# Altium schematic sheet DSO_IO.SchDoc: Schematic_Name
size A4; CompanyName: University of Melbourne; Engineer: Your Name Here; DocumentNumber: 1; Revision: 0.1; SheetNumber: 1; SheetTotal: 1; Title_Project: Project_Title; StudentNo: Student No.
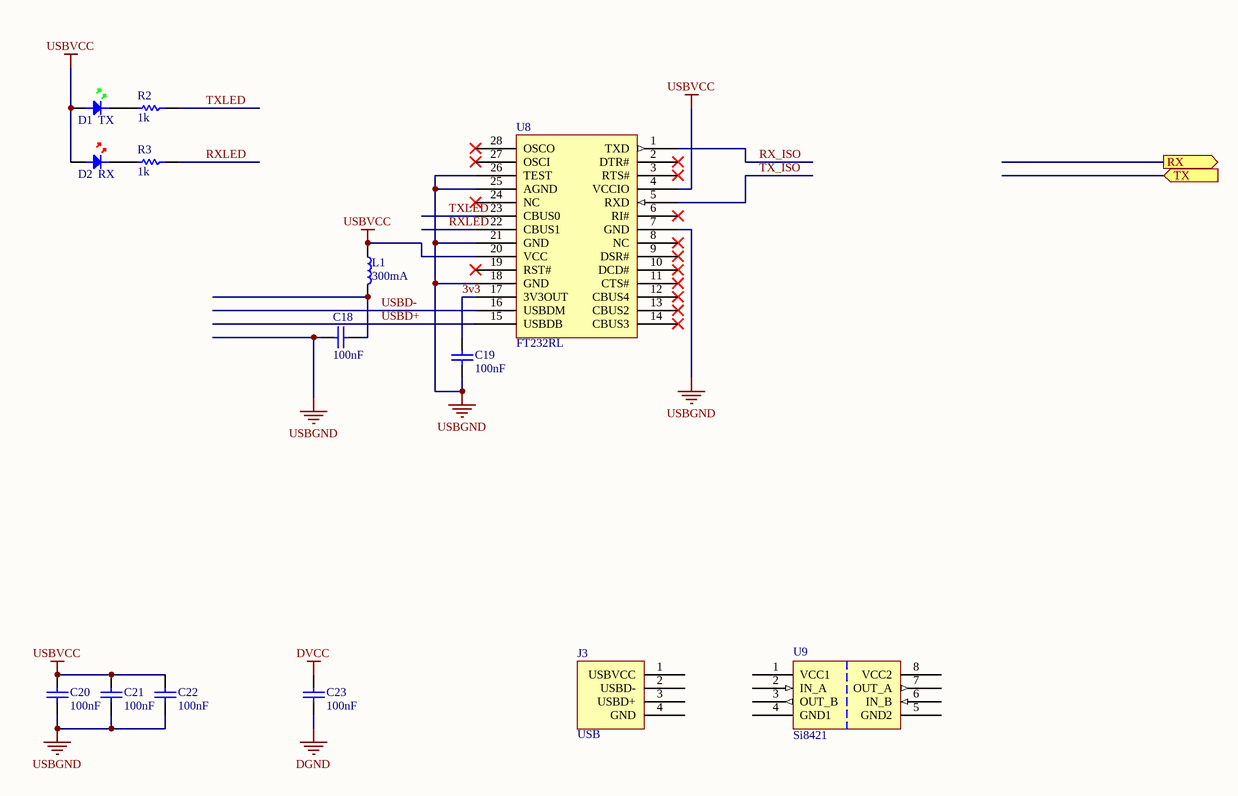
[diagram p0: DSO_IO.SchDoc]

## Parts
C18  100nF  [0805C]
C19  100nF  [0805C]
C20  100nF  [0805C]
C21  100nF  [0805C]
C22  100nF  [0805C]
C23  100nF  [0805C]
D1  TX  [0805D-GREEN]
D2  RX  [0805D-RED]
J3  USB  [USBPLUG]
L1  300mA  [0805]
R2  1k  [0805]
R3  1k  [0805]
U8  FT232RL  [SSOP-28]
U9  Si8421  [SOIC-8]

## Ports
RX (out), TX (in)

## Nets
DGND: C23.2
DVCC: C23.1
USBGND: C18.2 C19.2 C20.2 C21.2 C22.2 U8.7(GND) U8.18(GND) U8.21(GND) U8.25(AGND) U8.26(TEST)
USBVCC: C20.1 C21.1 C22.1 D1.A D2.A L1.1 U8.4(VCCIO) U8.20(VCC)
3v3: C19.1 U8.17(3V3OUT)
RX_ISO: U8.1(TXD)
RXLED: R3.1 U8.22(CBUS1)
TX_ISO: U8.5(RXD)
TXLED: R2.1 U8.23(CBUS0)
USBD+: U8.15(USBDB)
USBD-: U8.16(USBDM)
NetC18_1: C18.1 L1.2
NetD1_K: D1.K R2.2
NetD2_K: D2.K R3.2

Not connected (* = marked no-connect by the designer): J3 1(USBVCC) 2(USBD-) 3(USBD+) 4(GND); U8 2(DTR#)* 3(RTS#)* 6(RI#)* 8(NC)* 9(DSR#)* 10(DCD#)* 11(CTS#)* 12(CBUS4)* 13(CBUS2)* 14(CBUS3)* 19(RST#)* 24(NC)* 27(OSCI)* 28(OSCO)*; U9 1(VCC1) 2(IN_A) 3(OUT_B) 4(GND1) 5(GND2) 6(IN_B) 7(OUT_A) 8(VCC2)

## Library data of the parts
C18-C23 = C: Capacitor; Reviewed by: RM - 2018/08/05; Revision: July-2002: Re-released for DXP Platform.; Value: 100nF; Supplier 1: *; Supplier Part Number 1: *
D1 = LED GREEN: Light Emitting Diode; Reviewed by: RM - 2018/08/05; Revision: July-2002: Re-released for DXP Platform.; Supplier 1: Digi-Key; Supplier Part Number 1: 160-1423-1-ND
D2 = LED RED: Light Emitting Diode; Reviewed by: RM - 2018/08/05; Revision: July-2002: Re-released for DXP Platform.; Supplier 1: Digi-Key; Supplier Part Number 1: 475-1415-1-ND
J3 = USBPLUG: USB B Type Connector; Reviewed by: RM - 2018/08/05; Supplier 1: Digi-Key; Supplier Part Number 1: 609-1039-ND
L1 = I: Inductor; Reviewed by: RM - 2018/08/05; Value: 300mA; Supplier 1: *; Supplier Part Number 1: *
R2 R3 = R: Resistor; Reviewed by: RM - 2018/08/05; Value: 1k; Supplier 1: *; Suppler Part Number 1: *
U8 = FT232RL: USB to Serial bridge; Reviewed by: RM - 2018/08/05; Supplier 1: Digi-Key; Supplier Part Number 1: 768-1007-1-ND
U9 = Si8421: Dual Channel Digital Isolator Both Ways; Reviewed by: RM - 2018/08/05; Supplier 1: Digi-Key; Supplier Part Number 1: 336-1755-5-ND